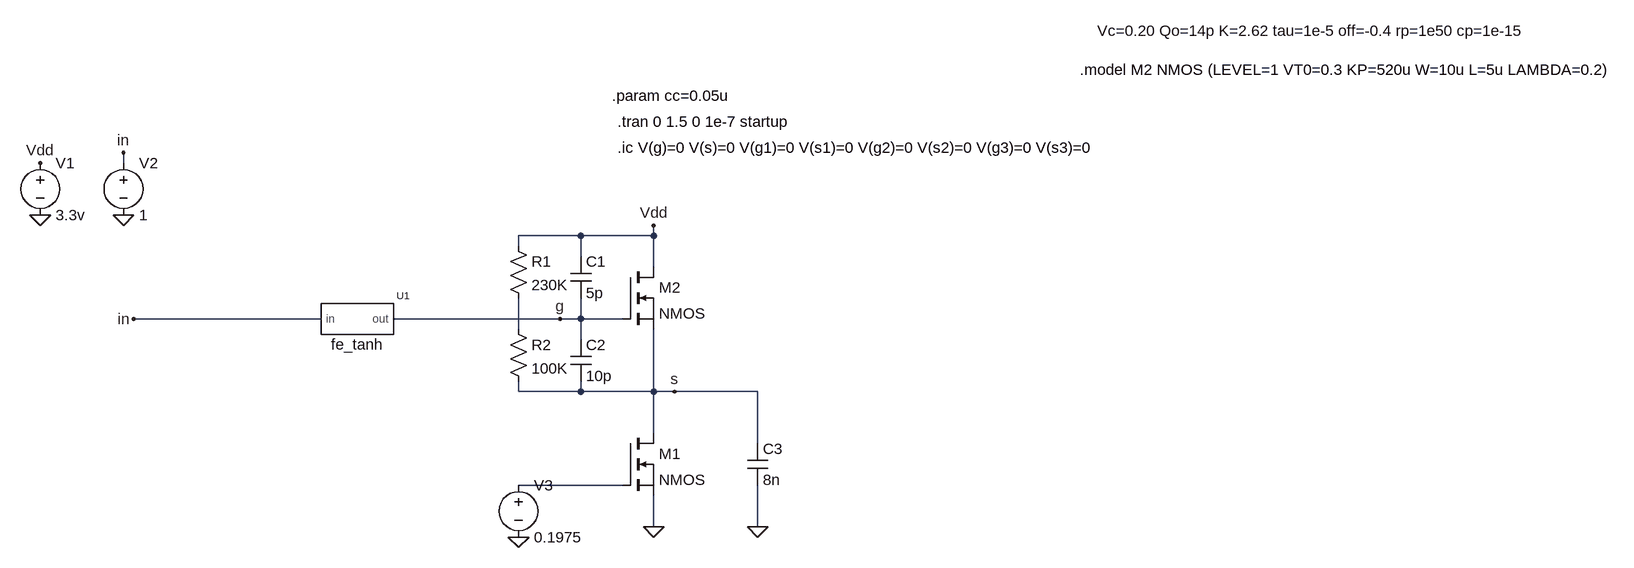
[diagram p0: schematic Oscilador_coupled_transistors_test.asc]
Oscilador_coupled_transistors_test.asc, the LTspice schematic file:
Version 4
SHEET 1 4392 704
WIRE -128 -48 -128 -64
WIRE 576 64 480 64
WIRE 688 64 688 48
WIRE 688 64 576 64
WIRE 480 80 480 64
WIRE 576 96 576 64
WIRE 688 112 688 64
WIRE 176 192 -112 192
WIRE 544 192 288 192
WIRE 576 192 576 160
WIRE 576 192 544 192
WIRE 640 192 576 192
WIRE 480 208 480 160
WIRE 576 224 576 192
WIRE 480 304 480 288
WIRE 576 304 576 288
WIRE 576 304 480 304
WIRE 688 304 688 208
WIRE 688 304 576 304
WIRE 720 304 688 304
WIRE 848 304 720 304
WIRE 688 368 688 304
WIRE 848 384 848 304
WIRE 640 448 480 448
WIRE 688 512 688 464
WIRE 848 512 848 448
FLAG -256 32 0
FLAG -256 -48 Vdd
FLAG 688 48 Vdd
FLAG 688 512 0
FLAG 848 512 0
FLAG -128 32 0
FLAG -112 192 in
FLAG -128 -64 in
FLAG 544 192 g
FLAG 720 304 s
FLAG 480 528 0
SYMBOL voltage -256 -64 R0
WINDOW 123 0 0 Left 0
WINDOW 39 0 0 Left 0
SYMATTR InstName V1
SYMATTR Value 3.3v
SYMBOL cap 560 96 R0
SYMATTR InstName C1
SYMATTR Value 5p
SYMBOL cap 560 224 R0
SYMATTR InstName C2
SYMATTR Value 10p
SYMBOL cap 832 384 R0
SYMATTR InstName C3
SYMATTR Value 8n
SYMBOL voltage -128 -64 R0
WINDOW 123 0 0 Left 0
WINDOW 39 0 0 Left 0
SYMATTR InstName V2
SYMATTR Value 1
SYMBOL fe_tanh 224 192 R0
WINDOW 39 1480 -459 Top 2
SYMATTR SpiceLine Vc=0.20 Qo=14p K=2.62 tau=1e-5 off=-0.4 rp=1e50 cp=1e-15
SYMATTR InstName U1
SYMBOL nmos 640 368 R0
SYMATTR InstName M1
SYMBOL voltage 480 432 R0
WINDOW 123 0 0 Left 0
WINDOW 39 0 0 Left 0
SYMATTR InstName V3
SYMATTR Value 0.1975
SYMBOL nmos 640 112 R0
SYMATTR InstName M2
SYMBOL res 464 64 R0
SYMATTR InstName R1
SYMATTR Value 230K
SYMBOL res 464 192 R0
SYMATTR InstName R2
SYMATTR Value 100K
TEXT 632 -72 Left 2 !.ic V(g)=0 V(s)=0 V(g1)=0 V(s1)=0 V(g2)=0 V(s2)=0 V(g3)=0 V(s3)=0
TEXT 632 -112 Left 2 !.tran 0 1.5 0 1e-7 startup
TEXT 624 -152 Left 2 !.param cc=0.05u
TEXT 1344 -192 Left 2 !.model M2 NMOS (LEVEL=1 VT0=0.3 KP=520u W=10u L=5u LAMBDA=0.2)

The netlist it stands for:
* Oscilador_coupled_transistors_test.asc
V1 Vdd 0 3.3v
C1 Vdd g 5p
C2 g s 10p
C3 s 0 8n
V2 in 0 1
XU1 in g fe_tanh Vc=0.20 Qo=14p K=2.62 tau=1e-5 off=-0.4 rp=1e50 cp=1e-15  ; pins in out
M1 s N002 0 0 NMOS
V3 N002 0 0.1975
M2 Vdd g s s NMOS
R1 Vdd N001 230K
R2 N001 s 100K
.model NMOS NMOS
.model PMOS PMOS
.lib standard.mos
.ic V(g)=0 V(s)=0 V(g1)=0 V(s1)=0 V(g2)=0 V(s2)=0 V(g3)=0 V(s3)=0
.tran 0 1.5 0 1e-7 startup
.param cc=0.05u
.model M2 NMOS (LEVEL=1 VT0=0.3 KP=520u W=10u L=5u LAMBDA=0.2)
.lib ./fe_tanh_ni.sp
.backanno
.end